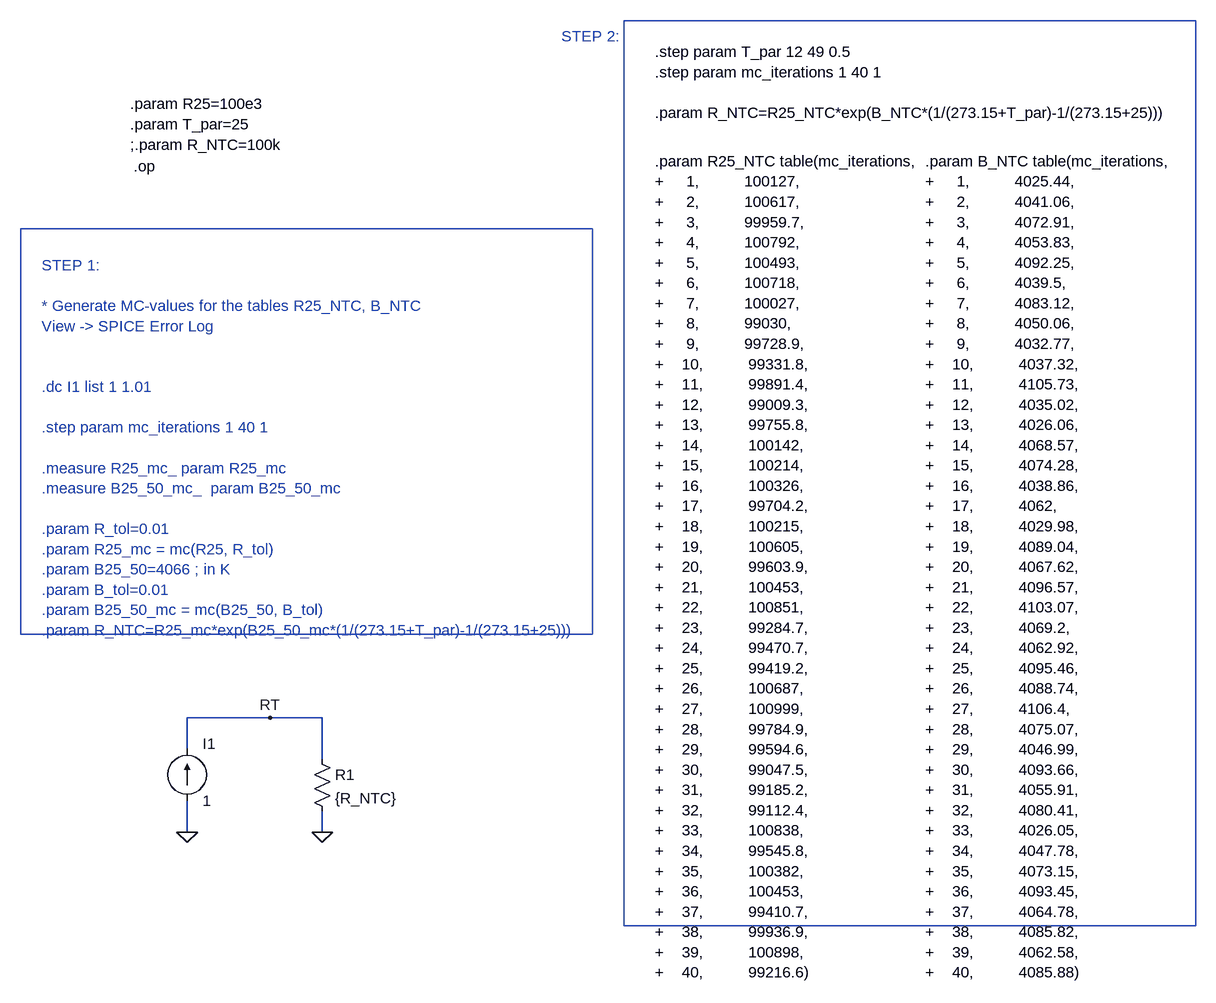
[diagram p0: schematic R_NTC_MC1.asc]
R_NTC_MC1.asc, the LTspice schematic file:
Version 4
SHEET 1 1508 1308
WIRE -208 576 -336 576
WIRE -128 576 -208 576
WIRE -336 624 -336 576
WIRE -128 640 -128 576
WIRE -336 752 -336 704
WIRE -128 752 -128 720
FLAG -336 752 0
FLAG -128 752 0
FLAG -208 576 RT
SYMBOL res -144 624 R0
SYMATTR InstName R1
SYMATTR Value {R_NTC}
SYMBOL current -336 704 M180
WINDOW 0 24 88 Left 0
WINDOW 3 24 0 Left 0
SYMATTR InstName I1
SYMATTR Value 1
TEXT -560 -120 Left 0 ;STEP 1:\n \n* Generate MC-values for the tables R25_NTC, B_NTC\nView -> SPICE Error Log\n \n \n.dc I1 list 1 1.01\n \n.step param mc_iterations 1 40 1\n \n.measure R25_mc_ param R25_mc\n.measure B25_50_mc_  param B25_50_mc\n \n.param R_tol=0.01\n.param R25_mc = mc(R25, R_tol)\n.param B25_50=4066 ; in K\n.param B_tol=0.01\n.param B25_50_mc = mc(B25_50, B_tol)\n.param R_NTC=R25_mc*exp(B25_50_mc*(1/(273.15+T_par)-1/(273.15+25)))
TEXT 384 -448 Left 0 !.step param T_par 12 49 0.5\n.step param mc_iterations 1 40 1\n   \n.param R_NTC=R25_NTC*exp(B_NTC*(1/(273.15+T_par)-1/(273.15+25)))
TEXT -418 -272 Left 0 !.op
TEXT -424 -368 Left 0 !.param R25=100e3\n.param T_par=25\n;.param R_NTC=100k
TEXT 384 -280 Left 0 !.param R25_NTC table(mc_iterations, \n+     1,          100127,\n+     2,          100617,\n+     3,          99959.7,\n+     4,          100792,\n+     5,          100493,\n+     6,          100718,\n+     7,          100027,\n+     8,          99030,\n+     9,          99728.9,\n+    10,          99331.8,\n+    11,          99891.4,\n+    12,          99009.3,\n+    13,          99755.8,\n+    14,          100142,\n+    15,          100214,\n+    16,          100326,\n+    17,          99704.2,\n+    18,          100215,\n+    19,          100605,\n+    20,          99603.9,\n+    21,          100453,\n+    22,          100851,\n+    23,          99284.7,\n+    24,          99470.7,\n+    25,          99419.2,\n+    26,          100687,\n+    27,          100999,\n+    28,          99784.9,\n+    29,          99594.6,\n+    30,          99047.5,\n+    31,          99185.2,\n+    32,          99112.4,\n+    33,          100838,\n+    34,          99545.8,\n+    35,          100382,\n+    36,          100453,\n+    37,          99410.7,\n+    38,          99936.9,\n+    39,          100898,\n+    40,          99216.6)
TEXT 800 -280 Left 0 !.param B_NTC table(mc_iterations,\n+     1,          4025.44,\n+     2,          4041.06,\n+     3,          4072.91,\n+     4,          4053.83,\n+     5,          4092.25,\n+     6,          4039.5,\n+     7,          4083.12,\n+     8,          4050.06,\n+     9,          4032.77,\n+    10,          4037.32,\n+    11,          4105.73,\n+    12,          4035.02,\n+    13,          4026.06,\n+    14,          4068.57,\n+    15,          4074.28,\n+    16,          4038.86,\n+    17,          4062,\n+    18,          4029.98,\n+    19,          4089.04,\n+    20,          4067.62,\n+    21,          4096.57,\n+    22,          4103.07,\n+    23,          4069.2,\n+    24,          4062.92,\n+    25,          4095.46,\n+    26,          4088.74,\n+    27,          4106.4,\n+    28,          4075.07,\n+    29,          4046.99,\n+    30,          4093.66,\n+    31,          4055.91,\n+    32,          4080.41,\n+    33,          4026.05,\n+    34,          4047.78,\n+    35,          4073.15,\n+    36,          4093.45,\n+    37,          4064.78,\n+    38,          4085.82,\n+    39,          4062.58,\n+    40,          4085.88)
TEXT 240 -472 Left 0 ;STEP 2:
RECTANGLE Normal 288 448 -592 -176
RECTANGLE Normal 1216 896 336 -496

The netlist it stands for:
* R_NTC_MC1.asc
R1 RT 0 {R_NTC}
I1 0 RT 1
* STEP 1:
* * Generate MC-values for the tables R25_NTC, B_NTC
* View -> SPICE Error Log
* .dc I1 list 1 1.01
* .step param mc_iterations 1 40 1
* .measure R25_mc_ param R25_mc
* .measure B25_50_mc_  param B25_50_mc
* .param R_tol=0.01
* .param R25_mc = mc(R25, R_tol)
* .param B25_50=4066 ; in K
* .param B_tol=0.01
* .param B25_50_mc = mc(B25_50, B_tol)
* .param R_NTC=R25_mc*exp(B25_50_mc*(1/(273.15+T_par)-1/(273.15+25)))
.step param T_par 12 49 0.5
.step param mc_iterations 1 40 1
.param R_NTC=R25_NTC*exp(B_NTC*(1/(273.15+T_par)-1/(273.15+25)))
.op
.param R25=100e3
.param T_par=25
;.param R_NTC=100k
.param R25_NTC table(mc_iterations,
+     1,          100127,
+     2,          100617,
+     3,          99959.7,
+     4,          100792,
+     5,          100493,
+     6,          100718,
+     7,          100027,
+     8,          99030,
+     9,          99728.9,
+    10,          99331.8,
+    11,          99891.4,
+    12,          99009.3,
+    13,          99755.8,
+    14,          100142,
+    15,          100214,
+    16,          100326,
+    17,          99704.2,
+    18,          100215,
+    19,          100605,
+    20,          99603.9,
+    21,          100453,
+    22,          100851,
+    23,          99284.7,
+    24,          99470.7,
+    25,          99419.2,
+    26,          100687,
+    27,          100999,
+    28,          99784.9,
+    29,          99594.6,
+    30,          99047.5,
+    31,          99185.2,
+    32,          99112.4,
+    33,          100838,
+    34,          99545.8,
+    35,          100382,
+    36,          100453,
+    37,          99410.7,
+    38,          99936.9,
+    39,          100898,
+    40,          99216.6)
.param B_NTC table(mc_iterations,
+     1,          4025.44,
+     2,          4041.06,
+     3,          4072.91,
+     4,          4053.83,
+     5,          4092.25,
+     6,          4039.5,
+     7,          4083.12,
+     8,          4050.06,
+     9,          4032.77,
+    10,          4037.32,
+    11,          4105.73,
+    12,          4035.02,
+    13,          4026.06,
+    14,          4068.57,
+    15,          4074.28,
+    16,          4038.86,
+    17,          4062,
+    18,          4029.98,
+    19,          4089.04,
+    20,          4067.62,
+    21,          4096.57,
+    22,          4103.07,
+    23,          4069.2,
+    24,          4062.92,
+    25,          4095.46,
+    26,          4088.74,
+    27,          4106.4,
+    28,          4075.07,
+    29,          4046.99,
+    30,          4093.66,
+    31,          4055.91,
+    32,          4080.41,
+    33,          4026.05,
+    34,          4047.78,
+    35,          4073.15,
+    36,          4093.45,
+    37,          4064.78,
+    38,          4085.82,
+    39,          4062.58,
+    40,          4085.88)
* STEP 2:
.backanno
.end